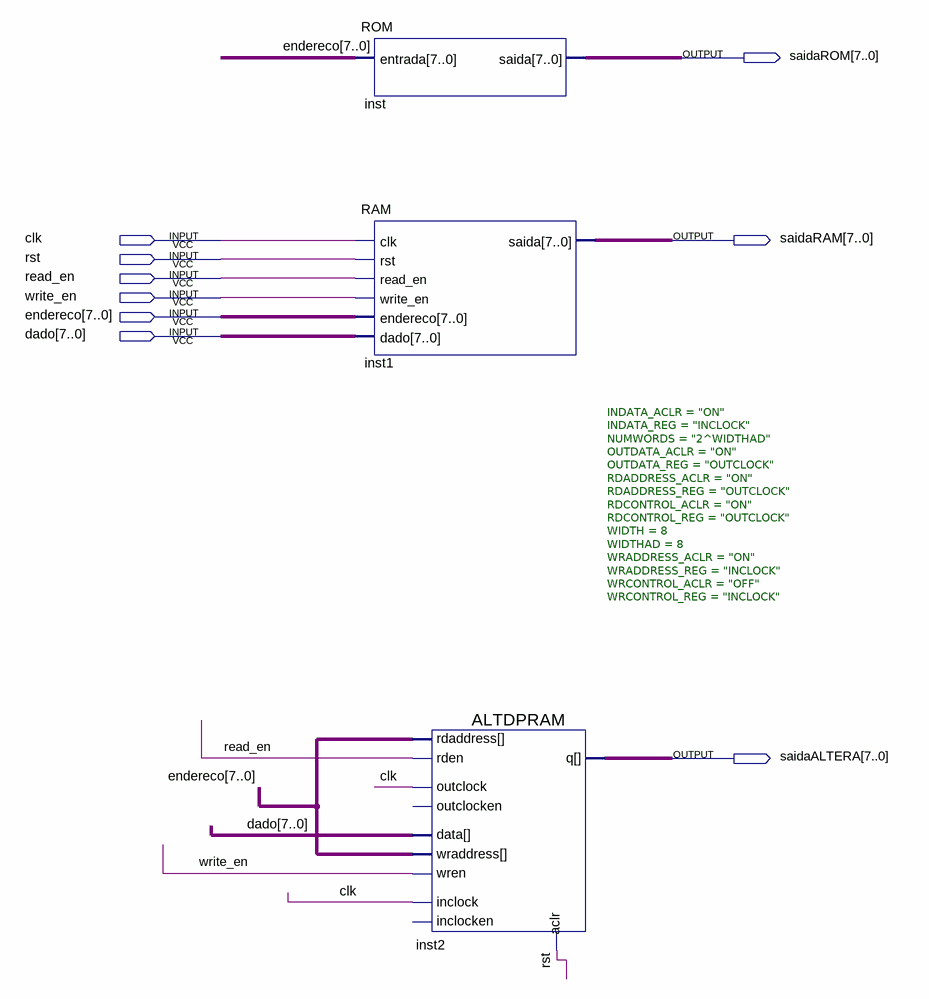
[diagram p0: schematic sheet]
// Quartus schematic exemplo_memorias.bdf as structural Verilog: 3 symbols, 9 pins
module exemplo_memorias (
  input  clk,
  input  rst,
  input  read_en,
  input  write_en,
  input  [7:0] endereco,
  input  [7:0] dado,
  output [7:0] saidaROM,
  output [7:0] saidaRAM,
  output [7:0] saidaALTERA
);

  ROM inst (.entrada(endereco), .saida(saidaROM));
  RAM inst1 (
    .clk(clk), .rst(rst), .read_en(read_en), .write_en(write_en), .endereco(endereco), .dado(dado),
    .saida(saidaRAM));
  ALTDPRAM #(.INDATA_ACLR("ON"), .INDATA_REG("INCLOCK"), .NUMWORDS("2^WIDTHAD"), .OUTDATA_ACLR("ON"), .OUTDATA_REG("OUTCLOCK"), .RDADDRESS_ACLR("ON"), .RDADDRESS_REG("OUTCLOCK"), .RDCONTROL_ACLR("ON"), .RDCONTROL_REG("OUTCLOCK"), .WIDTH(8), .WIDTHAD(8), .WRADDRESS_ACLR("ON"), .WRADDRESS_REG("INCLOCK"), .WRCONTROL_ACLR("OFF"), .WRCONTROL_REG("INCLOCK")) inst2 (
    .inclock(clk), .rdaddress(endereco), .rden(read_en), .wraddress(endereco), .data(dado), .outclock(clk),
    .wren(write_en), .aclr(rst), .q(saidaALTERA));  // open: inclocken, outclocken
endmodule
